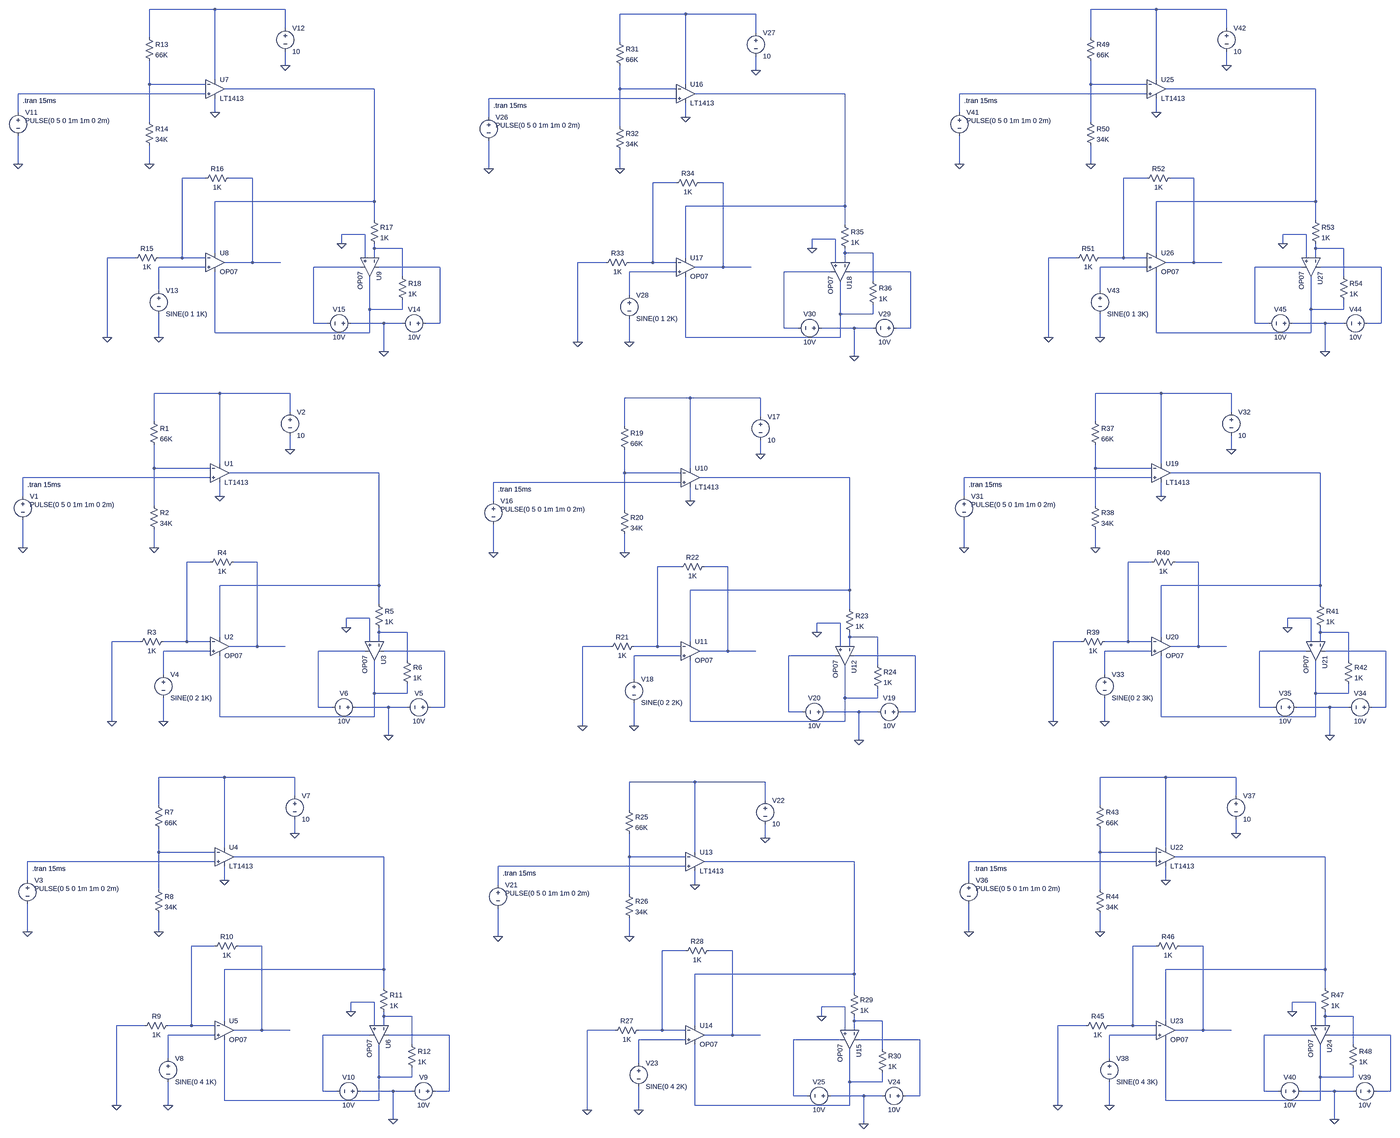
[diagram p0: schematic spice3a.asc, whole sheet]
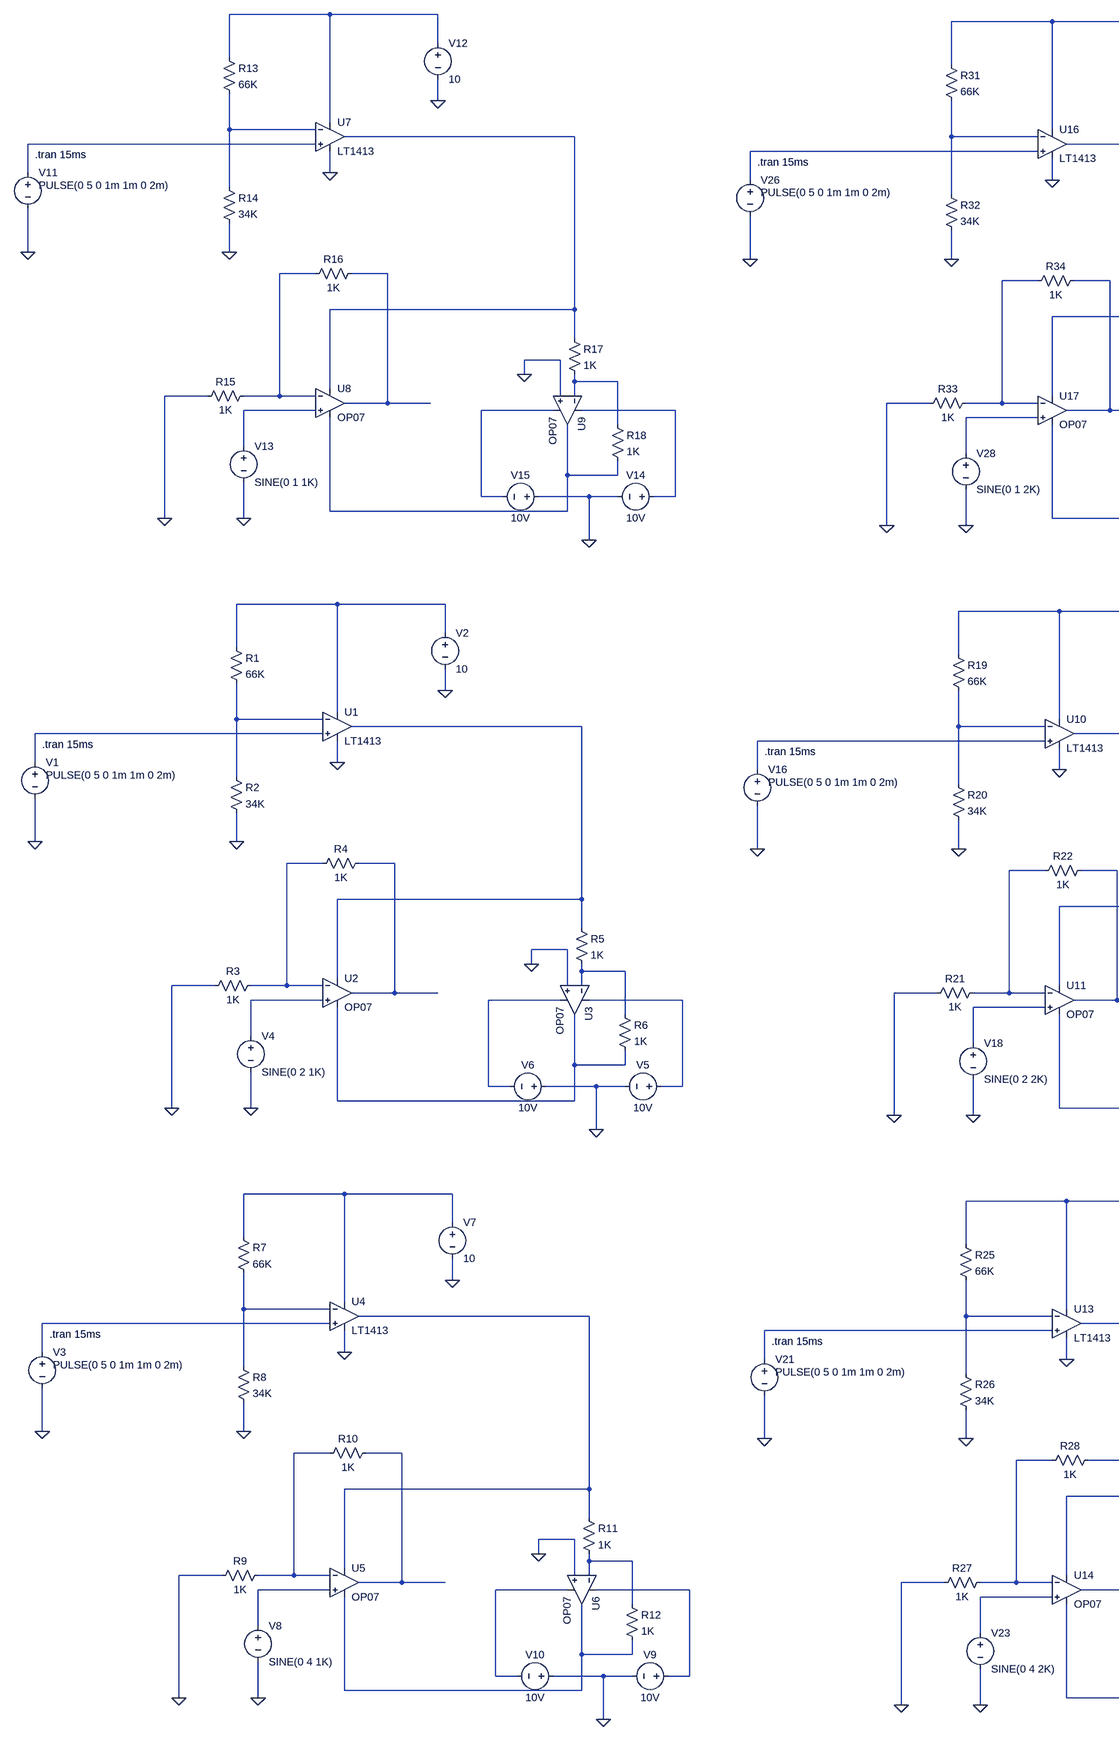
[diagram p1: schematic spice3a.asc, part, row 1 of 1, column 1 of 2]
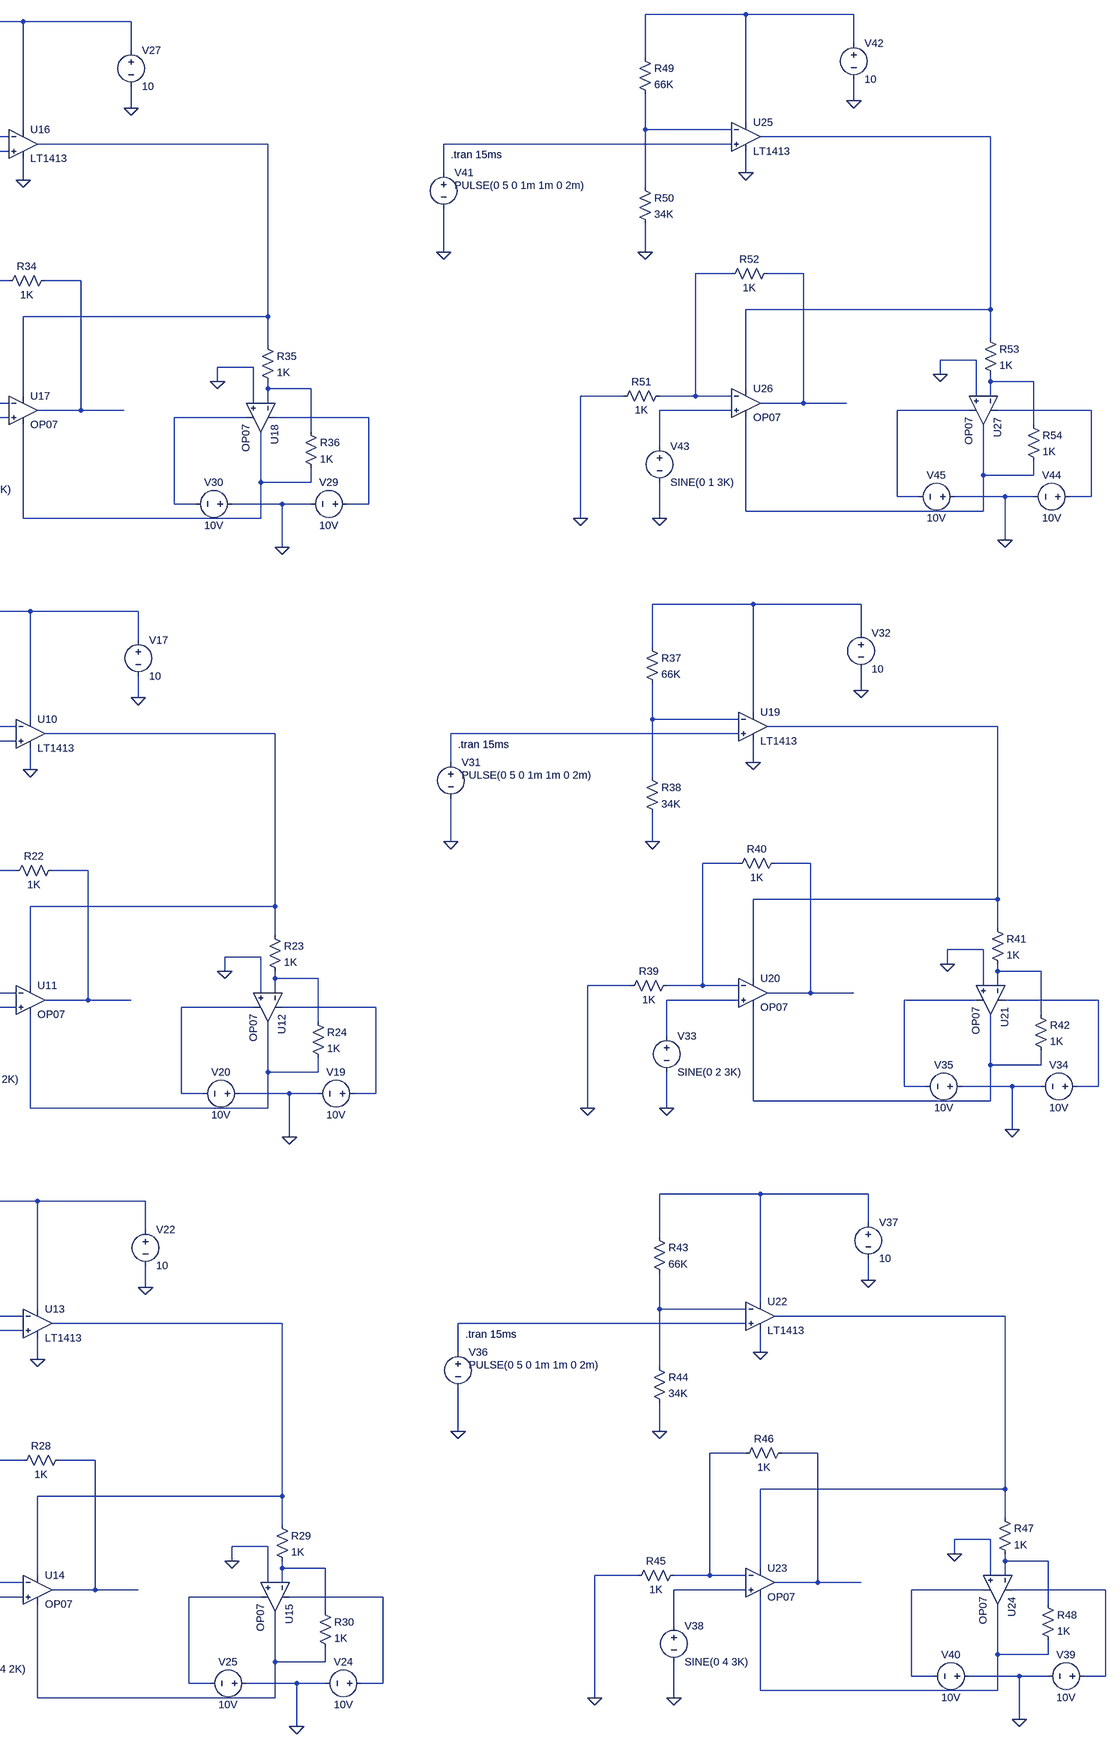
[diagram p2: schematic spice3a.asc, part, row 1 of 1, column 2 of 2]
spice3a.asc, the LTspice schematic file:
Version 4
SHEET 1 5652 2292
WIRE 528 -2000 304 -2000
WIRE 768 -2000 528 -2000
WIRE 4848 -2000 4624 -2000
WIRE 5088 -2000 4848 -2000
WIRE 2656 -1984 2432 -1984
WIRE 2896 -1984 2656 -1984
WIRE 768 -1936 768 -2000
WIRE 5088 -1936 5088 -2000
WIRE 2896 -1920 2896 -1984
WIRE 304 -1904 304 -2000
WIRE 4624 -1904 4624 -2000
WIRE 2432 -1888 2432 -1984
WIRE 768 -1808 768 -1856
WIRE 5088 -1808 5088 -1856
WIRE 2896 -1792 2896 -1840
WIRE 528 -1760 528 -2000
WIRE 4848 -1760 4848 -2000
WIRE 304 -1744 304 -1824
WIRE 496 -1744 304 -1744
WIRE 2656 -1744 2656 -1984
WIRE 4624 -1744 4624 -1824
WIRE 4816 -1744 4624 -1744
WIRE 1072 -1728 560 -1728
WIRE 2432 -1728 2432 -1808
WIRE 2624 -1728 2432 -1728
WIRE 5392 -1728 4880 -1728
WIRE 496 -1712 -144 -1712
WIRE 3200 -1712 2688 -1712
WIRE 4816 -1712 4176 -1712
WIRE 2624 -1696 1984 -1696
WIRE -144 -1648 -144 -1712
WIRE 528 -1648 528 -1696
WIRE 4176 -1648 4176 -1712
WIRE 4848 -1648 4848 -1696
WIRE 1984 -1632 1984 -1696
WIRE 2656 -1632 2656 -1680
WIRE 304 -1616 304 -1744
WIRE 4624 -1616 4624 -1744
WIRE 2432 -1600 2432 -1728
WIRE -144 -1472 -144 -1568
WIRE 304 -1472 304 -1536
WIRE 4176 -1472 4176 -1568
WIRE 4624 -1472 4624 -1536
WIRE 1984 -1456 1984 -1552
WIRE 2432 -1456 2432 -1520
WIRE 496 -1424 416 -1424
WIRE 656 -1424 576 -1424
WIRE 4816 -1424 4736 -1424
WIRE 4976 -1424 4896 -1424
WIRE 2624 -1408 2544 -1408
WIRE 2784 -1408 2704 -1408
WIRE 1072 -1344 1072 -1728
WIRE 1072 -1344 528 -1344
WIRE 5392 -1344 5392 -1728
WIRE 5392 -1344 4848 -1344
WIRE 3200 -1328 3200 -1712
WIRE 3200 -1328 2656 -1328
WIRE 1072 -1280 1072 -1344
WIRE 5392 -1280 5392 -1344
WIRE 3200 -1264 3200 -1328
WIRE 1040 -1232 960 -1232
WIRE 5360 -1232 5280 -1232
WIRE 3168 -1216 3088 -1216
WIRE 960 -1200 960 -1232
WIRE 5280 -1200 5280 -1232
WIRE 1072 -1184 1072 -1200
WIRE 1168 -1184 1072 -1184
WIRE 3088 -1184 3088 -1216
WIRE 5392 -1184 5392 -1200
WIRE 5488 -1184 5392 -1184
WIRE 528 -1168 528 -1344
WIRE 3200 -1168 3200 -1184
WIRE 3296 -1168 3200 -1168
WIRE 4848 -1168 4848 -1344
WIRE 256 -1152 160 -1152
WIRE 416 -1152 416 -1424
WIRE 416 -1152 336 -1152
WIRE 496 -1152 416 -1152
WIRE 1040 -1152 1040 -1232
WIRE 1072 -1152 1072 -1184
WIRE 2656 -1152 2656 -1328
WIRE 4576 -1152 4480 -1152
WIRE 4736 -1152 4736 -1424
WIRE 4736 -1152 4656 -1152
WIRE 4816 -1152 4736 -1152
WIRE 5360 -1152 5360 -1232
WIRE 5392 -1152 5392 -1184
WIRE 656 -1136 656 -1424
WIRE 656 -1136 560 -1136
WIRE 752 -1136 656 -1136
WIRE 2384 -1136 2288 -1136
WIRE 2544 -1136 2544 -1408
WIRE 2544 -1136 2464 -1136
WIRE 2624 -1136 2544 -1136
WIRE 3168 -1136 3168 -1216
WIRE 3200 -1136 3200 -1168
WIRE 4976 -1136 4976 -1424
WIRE 4976 -1136 4880 -1136
WIRE 5072 -1136 4976 -1136
WIRE 496 -1120 336 -1120
WIRE 1024 -1120 864 -1120
WIRE 1296 -1120 1088 -1120
WIRE 2784 -1120 2784 -1408
WIRE 2784 -1120 2688 -1120
WIRE 2880 -1120 2784 -1120
WIRE 4816 -1120 4656 -1120
WIRE 5344 -1120 5184 -1120
WIRE 5616 -1120 5408 -1120
WIRE 2624 -1104 2464 -1104
WIRE 3152 -1104 2992 -1104
WIRE 3424 -1104 3216 -1104
WIRE 1168 -1088 1168 -1184
WIRE 5488 -1088 5488 -1184
WIRE 3296 -1072 3296 -1168
WIRE 336 -1040 336 -1120
WIRE 4656 -1040 4656 -1120
WIRE 2464 -1024 2464 -1104
WIRE 1056 -976 1056 -1088
WIRE 1168 -976 1168 -1008
WIRE 1168 -976 1056 -976
WIRE 5376 -976 5376 -1088
WIRE 5488 -976 5488 -1008
WIRE 5488 -976 5376 -976
WIRE 3184 -960 3184 -1072
WIRE 3296 -960 3296 -992
WIRE 3296 -960 3184 -960
WIRE 864 -928 864 -1120
WIRE 912 -928 864 -928
WIRE 1104 -928 992 -928
WIRE 1168 -928 1104 -928
WIRE 1296 -928 1296 -1120
WIRE 1296 -928 1248 -928
WIRE 5184 -928 5184 -1120
WIRE 5232 -928 5184 -928
WIRE 5424 -928 5312 -928
WIRE 5488 -928 5424 -928
WIRE 5616 -928 5616 -1120
WIRE 5616 -928 5568 -928
WIRE 2992 -912 2992 -1104
WIRE 3040 -912 2992 -912
WIRE 3232 -912 3120 -912
WIRE 3296 -912 3232 -912
WIRE 3424 -912 3424 -1104
WIRE 3424 -912 3376 -912
WIRE 528 -896 528 -1104
WIRE 1056 -896 1056 -976
WIRE 1056 -896 528 -896
WIRE 4848 -896 4848 -1104
WIRE 5376 -896 5376 -976
WIRE 5376 -896 4848 -896
WIRE 160 -880 160 -1152
WIRE 336 -880 336 -960
WIRE 2656 -880 2656 -1088
WIRE 3184 -880 3184 -960
WIRE 3184 -880 2656 -880
WIRE 4480 -880 4480 -1152
WIRE 4656 -880 4656 -960
WIRE 2288 -864 2288 -1136
WIRE 2464 -864 2464 -944
WIRE 1104 -832 1104 -928
WIRE 5424 -832 5424 -928
WIRE 3232 -816 3232 -912
WIRE 544 -416 320 -416
WIRE 784 -416 544 -416
WIRE 4864 -416 4640 -416
WIRE 5104 -416 4864 -416
WIRE 2672 -400 2448 -400
WIRE 2912 -400 2672 -400
WIRE 784 -352 784 -416
WIRE 5104 -352 5104 -416
WIRE 2912 -336 2912 -400
WIRE 320 -320 320 -416
WIRE 4640 -320 4640 -416
WIRE 2448 -304 2448 -400
WIRE 784 -224 784 -272
WIRE 5104 -224 5104 -272
WIRE 2912 -208 2912 -256
WIRE 544 -176 544 -416
WIRE 4864 -176 4864 -416
WIRE 320 -160 320 -240
WIRE 512 -160 320 -160
WIRE 2672 -160 2672 -400
WIRE 4640 -160 4640 -240
WIRE 4832 -160 4640 -160
WIRE 1088 -144 576 -144
WIRE 2448 -144 2448 -224
WIRE 2640 -144 2448 -144
WIRE 5408 -144 4896 -144
WIRE 512 -128 -128 -128
WIRE 3216 -128 2704 -128
WIRE 4832 -128 4192 -128
WIRE 2640 -112 2000 -112
WIRE -128 -64 -128 -128
WIRE 544 -64 544 -112
WIRE 4192 -64 4192 -128
WIRE 4864 -64 4864 -112
WIRE 2000 -48 2000 -112
WIRE 2672 -48 2672 -96
WIRE 320 -32 320 -160
WIRE 4640 -32 4640 -160
WIRE 2448 -16 2448 -144
WIRE -128 112 -128 16
WIRE 320 112 320 48
WIRE 4192 112 4192 16
WIRE 4640 112 4640 48
WIRE 2000 128 2000 32
WIRE 2448 128 2448 64
WIRE 512 160 432 160
WIRE 672 160 592 160
WIRE 4832 160 4752 160
WIRE 4992 160 4912 160
WIRE 2640 176 2560 176
WIRE 2800 176 2720 176
WIRE 1088 240 1088 -144
WIRE 1088 240 544 240
WIRE 5408 240 5408 -144
WIRE 5408 240 4864 240
WIRE 3216 256 3216 -128
WIRE 3216 256 2672 256
WIRE 1088 304 1088 240
WIRE 5408 304 5408 240
WIRE 3216 320 3216 256
WIRE 1056 352 976 352
WIRE 5376 352 5296 352
WIRE 3184 368 3104 368
WIRE 976 384 976 352
WIRE 5296 384 5296 352
WIRE 1088 400 1088 384
WIRE 1184 400 1088 400
WIRE 3104 400 3104 368
WIRE 5408 400 5408 384
WIRE 5504 400 5408 400
WIRE 544 416 544 240
WIRE 3216 416 3216 400
WIRE 3312 416 3216 416
WIRE 4864 416 4864 240
WIRE 272 432 176 432
WIRE 432 432 432 160
WIRE 432 432 352 432
WIRE 512 432 432 432
WIRE 1056 432 1056 352
WIRE 1088 432 1088 400
WIRE 2672 432 2672 256
WIRE 4592 432 4496 432
WIRE 4752 432 4752 160
WIRE 4752 432 4672 432
WIRE 4832 432 4752 432
WIRE 5376 432 5376 352
WIRE 5408 432 5408 400
WIRE 672 448 672 160
WIRE 672 448 576 448
WIRE 768 448 672 448
WIRE 2400 448 2304 448
WIRE 2560 448 2560 176
WIRE 2560 448 2480 448
WIRE 2640 448 2560 448
WIRE 3184 448 3184 368
WIRE 3216 448 3216 416
WIRE 4992 448 4992 160
WIRE 4992 448 4896 448
WIRE 5088 448 4992 448
WIRE 512 464 352 464
WIRE 1040 464 880 464
WIRE 1312 464 1104 464
WIRE 2800 464 2800 176
WIRE 2800 464 2704 464
WIRE 2896 464 2800 464
WIRE 4832 464 4672 464
WIRE 5360 464 5200 464
WIRE 5632 464 5424 464
WIRE 2640 480 2480 480
WIRE 3168 480 3008 480
WIRE 3440 480 3232 480
WIRE 1184 496 1184 400
WIRE 5504 496 5504 400
WIRE 3312 512 3312 416
WIRE 352 544 352 464
WIRE 4672 544 4672 464
WIRE 2480 560 2480 480
WIRE 1072 608 1072 496
WIRE 1184 608 1184 576
WIRE 1184 608 1072 608
WIRE 5392 608 5392 496
WIRE 5504 608 5504 576
WIRE 5504 608 5392 608
WIRE 3200 624 3200 512
WIRE 3312 624 3312 592
WIRE 3312 624 3200 624
WIRE 880 656 880 464
WIRE 928 656 880 656
WIRE 1120 656 1008 656
WIRE 1184 656 1120 656
WIRE 1312 656 1312 464
WIRE 1312 656 1264 656
WIRE 5200 656 5200 464
WIRE 5248 656 5200 656
WIRE 5440 656 5328 656
WIRE 5504 656 5440 656
WIRE 5632 656 5632 464
WIRE 5632 656 5584 656
WIRE 3008 672 3008 480
WIRE 3056 672 3008 672
WIRE 3248 672 3136 672
WIRE 3312 672 3248 672
WIRE 3440 672 3440 480
WIRE 3440 672 3392 672
WIRE 544 688 544 480
WIRE 1072 688 1072 608
WIRE 1072 688 544 688
WIRE 4864 688 4864 480
WIRE 5392 688 5392 608
WIRE 5392 688 4864 688
WIRE 176 704 176 432
WIRE 352 704 352 624
WIRE 2672 704 2672 496
WIRE 3200 704 3200 624
WIRE 3200 704 2672 704
WIRE 4496 704 4496 432
WIRE 4672 704 4672 624
WIRE 2304 720 2304 448
WIRE 2480 720 2480 640
WIRE 1120 752 1120 656
WIRE 5440 752 5440 656
WIRE 3248 768 3248 672
WIRE 560 1088 336 1088
WIRE 800 1088 560 1088
WIRE 4880 1088 4656 1088
WIRE 5120 1088 4880 1088
WIRE 2688 1104 2464 1104
WIRE 2928 1104 2688 1104
WIRE 800 1152 800 1088
WIRE 5120 1152 5120 1088
WIRE 2928 1168 2928 1104
WIRE 336 1184 336 1088
WIRE 4656 1184 4656 1088
WIRE 2464 1200 2464 1104
WIRE 800 1280 800 1232
WIRE 5120 1280 5120 1232
WIRE 2928 1296 2928 1248
WIRE 560 1328 560 1088
WIRE 4880 1328 4880 1088
WIRE 336 1344 336 1264
WIRE 528 1344 336 1344
WIRE 2688 1344 2688 1104
WIRE 4656 1344 4656 1264
WIRE 4848 1344 4656 1344
WIRE 1104 1360 592 1360
WIRE 2464 1360 2464 1280
WIRE 2656 1360 2464 1360
WIRE 5424 1360 4912 1360
WIRE 528 1376 -112 1376
WIRE 3232 1376 2720 1376
WIRE 4848 1376 4208 1376
WIRE 2656 1392 2016 1392
WIRE -112 1440 -112 1376
WIRE 560 1440 560 1392
WIRE 4208 1440 4208 1376
WIRE 4880 1440 4880 1392
WIRE 2016 1456 2016 1392
WIRE 2688 1456 2688 1408
WIRE 336 1472 336 1344
WIRE 4656 1472 4656 1344
WIRE 2464 1488 2464 1360
WIRE -112 1616 -112 1520
WIRE 336 1616 336 1552
WIRE 4208 1616 4208 1520
WIRE 4656 1616 4656 1552
WIRE 2016 1632 2016 1536
WIRE 2464 1632 2464 1568
WIRE 528 1664 448 1664
WIRE 688 1664 608 1664
WIRE 4848 1664 4768 1664
WIRE 5008 1664 4928 1664
WIRE 2656 1680 2576 1680
WIRE 2816 1680 2736 1680
WIRE 1104 1744 1104 1360
WIRE 1104 1744 560 1744
WIRE 5424 1744 5424 1360
WIRE 5424 1744 4880 1744
WIRE 3232 1760 3232 1376
WIRE 3232 1760 2688 1760
WIRE 1104 1808 1104 1744
WIRE 5424 1808 5424 1744
WIRE 3232 1824 3232 1760
WIRE 1072 1856 992 1856
WIRE 5392 1856 5312 1856
WIRE 3200 1872 3120 1872
WIRE 992 1888 992 1856
WIRE 5312 1888 5312 1856
WIRE 1104 1904 1104 1888
WIRE 1200 1904 1104 1904
WIRE 3120 1904 3120 1872
WIRE 5424 1904 5424 1888
WIRE 5520 1904 5424 1904
WIRE 560 1920 560 1744
WIRE 3232 1920 3232 1904
WIRE 3328 1920 3232 1920
WIRE 4880 1920 4880 1744
WIRE 288 1936 192 1936
WIRE 448 1936 448 1664
WIRE 448 1936 368 1936
WIRE 528 1936 448 1936
WIRE 1072 1936 1072 1856
WIRE 1104 1936 1104 1904
WIRE 2688 1936 2688 1760
WIRE 4608 1936 4512 1936
WIRE 4768 1936 4768 1664
WIRE 4768 1936 4688 1936
WIRE 4848 1936 4768 1936
WIRE 5392 1936 5392 1856
WIRE 5424 1936 5424 1904
WIRE 688 1952 688 1664
WIRE 688 1952 592 1952
WIRE 784 1952 688 1952
WIRE 2416 1952 2320 1952
WIRE 2576 1952 2576 1680
WIRE 2576 1952 2496 1952
WIRE 2656 1952 2576 1952
WIRE 3200 1952 3200 1872
WIRE 3232 1952 3232 1920
WIRE 5008 1952 5008 1664
WIRE 5008 1952 4912 1952
WIRE 5104 1952 5008 1952
WIRE 528 1968 368 1968
WIRE 1056 1968 896 1968
WIRE 1328 1968 1120 1968
WIRE 2816 1968 2816 1680
WIRE 2816 1968 2720 1968
WIRE 2912 1968 2816 1968
WIRE 4848 1968 4688 1968
WIRE 5376 1968 5216 1968
WIRE 5648 1968 5440 1968
WIRE 2656 1984 2496 1984
WIRE 3184 1984 3024 1984
WIRE 3456 1984 3248 1984
WIRE 1200 2000 1200 1904
WIRE 5520 2000 5520 1904
WIRE 3328 2016 3328 1920
WIRE 368 2048 368 1968
WIRE 4688 2048 4688 1968
WIRE 2496 2064 2496 1984
WIRE 1088 2112 1088 2000
WIRE 1200 2112 1200 2080
WIRE 1200 2112 1088 2112
WIRE 5408 2112 5408 2000
WIRE 5520 2112 5520 2080
WIRE 5520 2112 5408 2112
WIRE 3216 2128 3216 2016
WIRE 3328 2128 3328 2096
WIRE 3328 2128 3216 2128
WIRE 896 2160 896 1968
WIRE 944 2160 896 2160
WIRE 1136 2160 1024 2160
WIRE 1200 2160 1136 2160
WIRE 1328 2160 1328 1968
WIRE 1328 2160 1280 2160
WIRE 5216 2160 5216 1968
WIRE 5264 2160 5216 2160
WIRE 5456 2160 5344 2160
WIRE 5520 2160 5456 2160
WIRE 5648 2160 5648 1968
WIRE 5648 2160 5600 2160
WIRE 3024 2176 3024 1984
WIRE 3072 2176 3024 2176
WIRE 3264 2176 3152 2176
WIRE 3328 2176 3264 2176
WIRE 3456 2176 3456 1984
WIRE 3456 2176 3408 2176
WIRE 560 2192 560 1984
WIRE 1088 2192 1088 2112
WIRE 1088 2192 560 2192
WIRE 4880 2192 4880 1984
WIRE 5408 2192 5408 2112
WIRE 5408 2192 4880 2192
WIRE 192 2208 192 1936
WIRE 368 2208 368 2128
WIRE 2688 2208 2688 2000
WIRE 3216 2208 3216 2128
WIRE 3216 2208 2688 2208
WIRE 4512 2208 4512 1936
WIRE 4688 2208 4688 2128
WIRE 2320 2224 2320 1952
WIRE 2496 2224 2496 2144
WIRE 1136 2256 1136 2160
WIRE 5456 2256 5456 2160
WIRE 3264 2272 3264 2176
FLAG -128 112 0
FLAG 784 -224 0
FLAG 320 112 0
FLAG 544 -64 0
FLAG 352 704 0
FLAG 176 704 0
FLAG 976 384 0
FLAG 1120 752 0
FLAG -112 1616 0
FLAG 800 1280 0
FLAG 336 1616 0
FLAG 560 1440 0
FLAG 368 2208 0
FLAG 192 2208 0
FLAG 992 1888 0
FLAG 1136 2256 0
FLAG -144 -1472 0
FLAG 768 -1808 0
FLAG 304 -1472 0
FLAG 528 -1648 0
FLAG 336 -880 0
FLAG 160 -880 0
FLAG 960 -1200 0
FLAG 1104 -832 0
FLAG 2000 128 0
FLAG 2912 -208 0
FLAG 2448 128 0
FLAG 2672 -48 0
FLAG 2480 720 0
FLAG 2304 720 0
FLAG 3104 400 0
FLAG 3248 768 0
FLAG 2016 1632 0
FLAG 2928 1296 0
FLAG 2464 1632 0
FLAG 2688 1456 0
FLAG 2496 2224 0
FLAG 2320 2224 0
FLAG 3120 1904 0
FLAG 3264 2272 0
FLAG 1984 -1456 0
FLAG 2896 -1792 0
FLAG 2432 -1456 0
FLAG 2656 -1632 0
FLAG 2464 -864 0
FLAG 2288 -864 0
FLAG 3088 -1184 0
FLAG 3232 -816 0
FLAG 4192 112 0
FLAG 5104 -224 0
FLAG 4640 112 0
FLAG 4864 -64 0
FLAG 4672 704 0
FLAG 4496 704 0
FLAG 5296 384 0
FLAG 5440 752 0
FLAG 4208 1616 0
FLAG 5120 1280 0
FLAG 4656 1616 0
FLAG 4880 1440 0
FLAG 4688 2208 0
FLAG 4512 2208 0
FLAG 5312 1888 0
FLAG 5456 2256 0
FLAG 4176 -1472 0
FLAG 5088 -1808 0
FLAG 4624 -1472 0
FLAG 4848 -1648 0
FLAG 4656 -880 0
FLAG 4480 -880 0
FLAG 5280 -1200 0
FLAG 5424 -832 0
SYMBOL voltage -128 -80 R0
WINDOW 3 24 44 Left 2
WINDOW 123 0 0 Left 0
WINDOW 39 0 0 Left 0
SYMATTR Value PULSE(0 5 0 1m 1m 0 2m)
SYMATTR InstName V1
SYMBOL OpAmps\\LT1413 544 -208 R0
SYMATTR InstName U1
SYMBOL res 304 -336 R0
SYMATTR InstName R1
SYMATTR Value 66K
SYMBOL res 304 -48 R0
SYMATTR InstName R2
SYMATTR Value 34K
SYMBOL voltage 784 -368 R0
WINDOW 123 0 0 Left 0
WINDOW 39 0 0 Left 0
SYMATTR InstName V2
SYMATTR Value 10
SYMBOL OpAmps\\OP07 544 384 R0
SYMATTR InstName U2
SYMBOL voltage 352 528 R0
WINDOW 123 0 0 Left 0
WINDOW 39 0 0 Left 0
SYMATTR InstName V4
SYMATTR Value SINE(0 2 1K)
SYMBOL res 368 416 R90
WINDOW 0 0 56 VBottom 2
WINDOW 3 32 56 VTop 2
SYMATTR InstName R3
SYMATTR Value 1K
SYMBOL res 608 144 R90
WINDOW 0 0 56 VBottom 2
WINDOW 3 32 56 VTop 2
SYMATTR InstName R4
SYMATTR Value 1K
SYMBOL OpAmps\\OP07 1136 464 R90
SYMATTR InstName U3
SYMBOL res 1072 288 R0
SYMATTR InstName R5
SYMATTR Value 1K
SYMBOL voltage 1280 656 R90
WINDOW 0 -32 56 VBottom 2
WINDOW 3 32 56 VTop 2
WINDOW 123 0 0 Left 0
WINDOW 39 0 0 Left 0
SYMATTR InstName V5
SYMATTR Value 10V
SYMBOL voltage 1024 656 R90
WINDOW 0 -32 56 VBottom 2
WINDOW 3 32 56 VTop 2
WINDOW 123 0 0 Left 0
WINDOW 39 0 0 Left 0
SYMATTR InstName V6
SYMATTR Value 10V
SYMBOL res 1168 480 R0
SYMATTR InstName R6
SYMATTR Value 1K
SYMBOL voltage -112 1424 R0
WINDOW 3 24 44 Left 2
WINDOW 123 0 0 Left 0
WINDOW 39 0 0 Left 0
SYMATTR Value PULSE(0 5 0 1m 1m 0 2m)
SYMATTR InstName V3
SYMBOL OpAmps\\LT1413 560 1296 R0
SYMATTR InstName U4
SYMBOL res 320 1168 R0
SYMATTR InstName R7
SYMATTR Value 66K
SYMBOL res 320 1456 R0
SYMATTR InstName R8
SYMATTR Value 34K
SYMBOL voltage 800 1136 R0
WINDOW 123 0 0 Left 0
WINDOW 39 0 0 Left 0
SYMATTR InstName V7
SYMATTR Value 10
SYMBOL OpAmps\\OP07 560 1888 R0
SYMATTR InstName U5
SYMBOL voltage 368 2032 R0
WINDOW 123 0 0 Left 0
WINDOW 39 0 0 Left 0
SYMATTR InstName V8
SYMATTR Value SINE(0 4 1K)
SYMBOL res 384 1920 R90
WINDOW 0 0 56 VBottom 2
WINDOW 3 32 56 VTop 2
SYMATTR InstName R9
SYMATTR Value 1K
SYMBOL res 624 1648 R90
WINDOW 0 0 56 VBottom 2
WINDOW 3 32 56 VTop 2
SYMATTR InstName R10
SYMATTR Value 1K
SYMBOL OpAmps\\OP07 1152 1968 R90
SYMATTR InstName U6
SYMBOL res 1088 1792 R0
SYMATTR InstName R11
SYMATTR Value 1K
SYMBOL voltage 1296 2160 R90
WINDOW 0 -32 56 VBottom 2
WINDOW 3 32 56 VTop 2
WINDOW 123 0 0 Left 0
WINDOW 39 0 0 Left 0
SYMATTR InstName V9
SYMATTR Value 10V
SYMBOL voltage 1040 2160 R90
WINDOW 0 -32 56 VBottom 2
WINDOW 3 32 56 VTop 2
WINDOW 123 0 0 Left 0
WINDOW 39 0 0 Left 0
SYMATTR InstName V10
SYMATTR Value 10V
SYMBOL res 1184 1984 R0
SYMATTR InstName R12
SYMATTR Value 1K
SYMBOL voltage -144 -1664 R0
WINDOW 3 24 44 Left 2
WINDOW 123 0 0 Left 0
WINDOW 39 0 0 Left 0
SYMATTR Value PULSE(0 5 0 1m 1m 0 2m)
SYMATTR InstName V11
SYMBOL OpAmps\\LT1413 528 -1792 R0
SYMATTR InstName U7
SYMBOL res 288 -1920 R0
SYMATTR InstName R13
SYMATTR Value 66K
SYMBOL res 288 -1632 R0
SYMATTR InstName R14
SYMATTR Value 34K
SYMBOL voltage 768 -1952 R0
WINDOW 123 0 0 Left 0
WINDOW 39 0 0 Left 0
SYMATTR InstName V12
SYMATTR Value 10
SYMBOL OpAmps\\OP07 528 -1200 R0
SYMATTR InstName U8
SYMBOL voltage 336 -1056 R0
WINDOW 123 0 0 Left 0
WINDOW 39 0 0 Left 0
SYMATTR InstName V13
SYMATTR Value SINE(0 1 1K)
SYMBOL res 352 -1168 R90
WINDOW 0 0 56 VBottom 2
WINDOW 3 32 56 VTop 2
SYMATTR InstName R15
SYMATTR Value 1K
SYMBOL res 592 -1440 R90
WINDOW 0 0 56 VBottom 2
WINDOW 3 32 56 VTop 2
SYMATTR InstName R16
SYMATTR Value 1K
SYMBOL OpAmps\\OP07 1120 -1120 R90
SYMATTR InstName U9
SYMBOL res 1056 -1296 R0
SYMATTR InstName R17
SYMATTR Value 1K
SYMBOL voltage 1264 -928 R90
WINDOW 0 -32 56 VBottom 2
WINDOW 3 32 56 VTop 2
WINDOW 123 0 0 Left 0
WINDOW 39 0 0 Left 0
SYMATTR InstName V14
SYMATTR Value 10V
SYMBOL voltage 1008 -928 R90
WINDOW 0 -32 56 VBottom 2
WINDOW 3 32 56 VTop 2
WINDOW 123 0 0 Left 0
WINDOW 39 0 0 Left 0
SYMATTR InstName V15
SYMATTR Value 10V
SYMBOL res 1152 -1104 R0
SYMATTR InstName R18
SYMATTR Value 1K
SYMBOL voltage 2000 -64 R0
WINDOW 3 24 44 Left 2
WINDOW 123 0 0 Left 0
WINDOW 39 0 0 Left 0
SYMATTR Value PULSE(0 5 0 1m 1m 0 2m)
SYMATTR InstName V16
SYMBOL OpAmps\\LT1413 2672 -192 R0
SYMATTR InstName U10
SYMBOL res 2432 -320 R0
SYMATTR InstName R19
SYMATTR Value 66K
SYMBOL res 2432 -32 R0
SYMATTR InstName R20
SYMATTR Value 34K
SYMBOL voltage 2912 -352 R0
WINDOW 123 0 0 Left 0
WINDOW 39 0 0 Left 0
SYMATTR InstName V17
SYMATTR Value 10
SYMBOL OpAmps\\OP07 2672 400 R0
SYMATTR InstName U11
SYMBOL voltage 2480 544 R0
WINDOW 123 0 0 Left 0
WINDOW 39 0 0 Left 0
SYMATTR InstName V18
SYMATTR Value SINE(0 2 2K)
SYMBOL res 2496 432 R90
WINDOW 0 0 56 VBottom 2
WINDOW 3 32 56 VTop 2
SYMATTR InstName R21
SYMATTR Value 1K
SYMBOL res 2736 160 R90
WINDOW 0 0 56 VBottom 2
WINDOW 3 32 56 VTop 2
SYMATTR InstName R22
SYMATTR Value 1K
SYMBOL OpAmps\\OP07 3264 480 R90
SYMATTR InstName U12
SYMBOL res 3200 304 R0
SYMATTR InstName R23
SYMATTR Value 1K
SYMBOL voltage 3408 672 R90
WINDOW 0 -32 56 VBottom 2
WINDOW 3 32 56 VTop 2
WINDOW 123 0 0 Left 0
WINDOW 39 0 0 Left 0
SYMATTR InstName V19
SYMATTR Value 10V
SYMBOL voltage 3152 672 R90
WINDOW 0 -32 56 VBottom 2
WINDOW 3 32 56 VTop 2
WINDOW 123 0 0 Left 0
WINDOW 39 0 0 Left 0
SYMATTR InstName V20
SYMATTR Value 10V
SYMBOL res 3296 496 R0
SYMATTR InstName R24
SYMATTR Value 1K
SYMBOL voltage 2016 1440 R0
WINDOW 3 24 44 Left 2
WINDOW 123 0 0 Left 0
WINDOW 39 0 0 Left 0
SYMATTR Value PULSE(0 5 0 1m 1m 0 2m)
SYMATTR InstName V21
SYMBOL OpAmps\\LT1413 2688 1312 R0
SYMATTR InstName U13
SYMBOL res 2448 1184 R0
SYMATTR InstName R25
SYMATTR Value 66K
SYMBOL res 2448 1472 R0
SYMATTR InstName R26
SYMATTR Value 34K
SYMBOL voltage 2928 1152 R0
WINDOW 123 0 0 Left 0
WINDOW 39 0 0 Left 0
SYMATTR InstName V22
SYMATTR Value 10
SYMBOL OpAmps\\OP07 2688 1904 R0
SYMATTR InstName U14
SYMBOL voltage 2496 2048 R0
WINDOW 123 0 0 Left 0
WINDOW 39 0 0 Left 0
SYMATTR InstName V23
SYMATTR Value SINE(0 4 2K)
SYMBOL res 2512 1936 R90
WINDOW 0 0 56 VBottom 2
WINDOW 3 32 56 VTop 2
SYMATTR InstName R27
SYMATTR Value 1K
SYMBOL res 2752 1664 R90
WINDOW 0 0 56 VBottom 2
WINDOW 3 32 56 VTop 2
SYMATTR InstName R28
SYMATTR Value 1K
SYMBOL OpAmps\\OP07 3280 1984 R90
SYMATTR InstName U15
SYMBOL res 3216 1808 R0
SYMATTR InstName R29
SYMATTR Value 1K
SYMBOL voltage 3424 2176 R90
WINDOW 0 -32 56 VBottom 2
WINDOW 3 32 56 VTop 2
WINDOW 123 0 0 Left 0
WINDOW 39 0 0 Left 0
SYMATTR InstName V24
SYMATTR Value 10V
SYMBOL voltage 3168 2176 R90
WINDOW 0 -32 56 VBottom 2
WINDOW 3 32 56 VTop 2
WINDOW 123 0 0 Left 0
WINDOW 39 0 0 Left 0
SYMATTR InstName V25
SYMATTR Value 10V
SYMBOL res 3312 2000 R0
SYMATTR InstName R30
SYMATTR Value 1K
SYMBOL voltage 1984 -1648 R0
WINDOW 3 24 44 Left 2
WINDOW 123 0 0 Left 0
WINDOW 39 0 0 Left 0
SYMATTR Value PULSE(0 5 0 1m 1m 0 2m)
SYMATTR InstName V26
SYMBOL OpAmps\\LT1413 2656 -1776 R0
SYMATTR InstName U16
SYMBOL res 2416 -1904 R0
SYMATTR InstName R31
SYMATTR Value 66K
SYMBOL res 2416 -1616 R0
SYMATTR InstName R32
SYMATTR Value 34K
SYMBOL voltage 2896 -1936 R0
WINDOW 123 0 0 Left 0
WINDOW 39 0 0 Left 0
SYMATTR InstName V27
SYMATTR Value 10
SYMBOL OpAmps\\OP07 2656 -1184 R0
SYMATTR InstName U17
SYMBOL voltage 2464 -1040 R0
WINDOW 123 0 0 Left 0
WINDOW 39 0 0 Left 0
SYMATTR InstName V28
SYMATTR Value SINE(0 1 2K)
SYMBOL res 2480 -1152 R90
WINDOW 0 0 56 VBottom 2
WINDOW 3 32 56 VTop 2
SYMATTR InstName R33
SYMATTR Value 1K
SYMBOL res 2720 -1424 R90
WINDOW 0 0 56 VBottom 2
WINDOW 3 32 56 VTop 2
SYMATTR InstName R34
SYMATTR Value 1K
SYMBOL OpAmps\\OP07 3248 -1104 R90
SYMATTR InstName U18
SYMBOL res 3184 -1280 R0
SYMATTR InstName R35
SYMATTR Value 1K
SYMBOL voltage 3392 -912 R90
WINDOW 0 -32 56 VBottom 2
WINDOW 3 32 56 VTop 2
WINDOW 123 0 0 Left 0
WINDOW 39 0 0 Left 0
SYMATTR InstName V29
SYMATTR Value 10V
SYMBOL voltage 3136 -912 R90
WINDOW 0 -32 56 VBottom 2
WINDOW 3 32 56 VTop 2
WINDOW 123 0 0 Left 0
WINDOW 39 0 0 Left 0
SYMATTR InstName V30
SYMATTR Value 10V
SYMBOL res 3280 -1088 R0
SYMATTR InstName R36
SYMATTR Value 1K
SYMBOL voltage 4192 -80 R0
WINDOW 3 24 44 Left 2
WINDOW 123 0 0 Left 0
WINDOW 39 0 0 Left 0
SYMATTR Value PULSE(0 5 0 1m 1m 0 2m)
SYMATTR InstName V31
SYMBOL OpAmps\\LT1413 4864 -208 R0
SYMATTR InstName U19
SYMBOL res 4624 -336 R0
SYMATTR InstName R37
SYMATTR Value 66K
SYMBOL res 4624 -48 R0
SYMATTR InstName R38
SYMATTR Value 34K
SYMBOL voltage 5104 -368 R0
WINDOW 123 0 0 Left 0
WINDOW 39 0 0 Left 0
SYMATTR InstName V32
SYMATTR Value 10
SYMBOL OpAmps\\OP07 4864 384 R0
SYMATTR InstName U20
SYMBOL voltage 4672 528 R0
WINDOW 123 0 0 Left 0
WINDOW 39 0 0 Left 0
SYMATTR InstName V33
SYMATTR Value SINE(0 2 3K)
SYMBOL res 4688 416 R90
WINDOW 0 0 56 VBottom 2
WINDOW 3 32 56 VTop 2
SYMATTR InstName R39
SYMATTR Value 1K
SYMBOL res 4928 144 R90
WINDOW 0 0 56 VBottom 2
WINDOW 3 32 56 VTop 2
SYMATTR InstName R40
SYMATTR Value 1K
SYMBOL OpAmps\\OP07 5456 464 R90
SYMATTR InstName U21
SYMBOL res 5392 288 R0
SYMATTR InstName R41
SYMATTR Value 1K
SYMBOL voltage 5600 656 R90
WINDOW 0 -32 56 VBottom 2
WINDOW 3 32 56 VTop 2
WINDOW 123 0 0 Left 0
WINDOW 39 0 0 Left 0
SYMATTR InstName V34
SYMATTR Value 10V
SYMBOL voltage 5344 656 R90
WINDOW 0 -32 56 VBottom 2
WINDOW 3 32 56 VTop 2
WINDOW 123 0 0 Left 0
WINDOW 39 0 0 Left 0
SYMATTR InstName V35
SYMATTR Value 10V
SYMBOL res 5488 480 R0
SYMATTR InstName R42
SYMATTR Value 1K
SYMBOL voltage 4208 1424 R0
WINDOW 3 24 44 Left 2
WINDOW 123 0 0 Left 0
WINDOW 39 0 0 Left 0
SYMATTR Value PULSE(0 5 0 1m 1m 0 2m)
SYMATTR InstName V36
SYMBOL OpAmps\\LT1413 4880 1296 R0
SYMATTR InstName U22
SYMBOL res 4640 1168 R0
SYMATTR InstName R43
SYMATTR Value 66K
SYMBOL res 4640 1456 R0
SYMATTR InstName R44
SYMATTR Value 34K
SYMBOL voltage 5120 1136 R0
WINDOW 123 0 0 Left 0
WINDOW 39 0 0 Left 0
SYMATTR InstName V37
SYMATTR Value 10
SYMBOL OpAmps\\OP07 4880 1888 R0
SYMATTR InstName U23
SYMBOL voltage 4688 2032 R0
WINDOW 123 0 0 Left 0
WINDOW 39 0 0 Left 0
SYMATTR InstName V38
SYMATTR Value SINE(0 4 3K)
SYMBOL res 4704 1920 R90
WINDOW 0 0 56 VBottom 2
WINDOW 3 32 56 VTop 2
SYMATTR InstName R45
SYMATTR Value 1K
SYMBOL res 4944 1648 R90
WINDOW 0 0 56 VBottom 2
WINDOW 3 32 56 VTop 2
SYMATTR InstName R46
SYMATTR Value 1K
SYMBOL OpAmps\\OP07 5472 1968 R90
SYMATTR InstName U24
SYMBOL res 5408 1792 R0
SYMATTR InstName R47
SYMATTR Value 1K
SYMBOL voltage 5616 2160 R90
WINDOW 0 -32 56 VBottom 2
WINDOW 3 32 56 VTop 2
WINDOW 123 0 0 Left 0
WINDOW 39 0 0 Left 0
SYMATTR InstName V39
SYMATTR Value 10V
SYMBOL voltage 5360 2160 R90
WINDOW 0 -32 56 VBottom 2
WINDOW 3 32 56 VTop 2
WINDOW 123 0 0 Left 0
WINDOW 39 0 0 Left 0
SYMATTR InstName V40
SYMATTR Value 10V
SYMBOL res 5504 1984 R0
SYMATTR InstName R48
SYMATTR Value 1K
SYMBOL voltage 4176 -1664 R0
WINDOW 3 24 44 Left 2
WINDOW 123 0 0 Left 0
WINDOW 39 0 0 Left 0
SYMATTR Value PULSE(0 5 0 1m 1m 0 2m)
SYMATTR InstName V41
SYMBOL OpAmps\\LT1413 4848 -1792 R0
SYMATTR InstName U25
SYMBOL res 4608 -1920 R0
SYMATTR InstName R49
SYMATTR Value 66K
SYMBOL res 4608 -1632 R0
SYMATTR InstName R50
SYMATTR Value 34K
SYMBOL voltage 5088 -1952 R0
WINDOW 123 0 0 Left 0
WINDOW 39 0 0 Left 0
SYMATTR InstName V42
SYMATTR Value 10
SYMBOL OpAmps\\OP07 4848 -1200 R0
SYMATTR InstName U26
SYMBOL voltage 4656 -1056 R0
WINDOW 123 0 0 Left 0
WINDOW 39 0 0 Left 0
SYMATTR InstName V43
SYMATTR Value SINE(0 1 3K)
SYMBOL res 4672 -1168 R90
WINDOW 0 0 56 VBottom 2
WINDOW 3 32 56 VTop 2
SYMATTR InstName R51
SYMATTR Value 1K
SYMBOL res 4912 -1440 R90
WINDOW 0 0 56 VBottom 2
WINDOW 3 32 56 VTop 2
SYMATTR InstName R52
SYMATTR Value 1K
SYMBOL OpAmps\\OP07 5440 -1120 R90
SYMATTR InstName U27
SYMBOL res 5376 -1296 R0
SYMATTR InstName R53
SYMATTR Value 1K
SYMBOL voltage 5584 -928 R90
WINDOW 0 -32 56 VBottom 2
WINDOW 3 32 56 VTop 2
WINDOW 123 0 0 Left 0
WINDOW 39 0 0 Left 0
SYMATTR InstName V44
SYMATTR Value 10V
SYMBOL voltage 5328 -928 R90
WINDOW 0 -32 56 VBottom 2
WINDOW 3 32 56 VTop 2
WINDOW 123 0 0 Left 0
WINDOW 39 0 0 Left 0
SYMATTR InstName V45
SYMATTR Value 10V
SYMBOL res 5472 -1104 R0
SYMATTR InstName R54
SYMATTR Value 1K
TEXT -112 -104 Left 2 !.tran 15ms
TEXT -96 1400 Left 2 !.tran 15ms
TEXT -128 -1688 Left 2 !.tran 15ms
TEXT 2016 -88 Left 2 !.tran 15ms
TEXT 2032 1416 Left 2 !.tran 15ms
TEXT 2000 -1672 Left 2 !.tran 15ms
TEXT 4208 -104 Left 2 !.tran 15ms
TEXT 4224 1400 Left 2 !.tran 15ms
TEXT 4192 -1688 Left 2 !.tran 15ms

The netlist it stands for:
* spice3a.asc
V1 N042 0 PULSE(0 5 0 1m 1m 0 2m)
XU1 N042 N037 N034 0 N039 LT1413  ; pins In+ In- V+ V- OUT
R1 N034 N037 66K
R2 N037 0 34K
V2 N034 0 10
XU2 N055 N046 N039 N064 N047 LT1001  ; OP07, pins In+ In- V+ V- OUT
V4 N055 0 SINE(0 2 1K)
R3 N046 0 1K
R4 N047 N046 1K
XU3 0 N052 N057 N056 N064 LT1001  ; OP07, pins In+ In- V+ V- OUT
R5 N039 N052 1K
V5 N057 0 10V
V6 0 N056 10V
R6 N052 N064 1K
V3 N075 0 PULSE(0 5 0 1m 1m 0 2m)
XU4 N075 N070 N067 0 N072 LT1413  ; pins In+ In- V+ V- OUT
R7 N067 N070 66K
R8 N070 0 34K
V7 N067 0 10
XU5 N088 N079 N072 N097 N080 LT1001  ; OP07, pins In+ In- V+ V- OUT
V8 N088 0 SINE(0 4 1K)
R9 N079 0 1K
R10 N080 N079 1K
XU6 0 N085 N090 N089 N097 LT1001  ; OP07, pins In+ In- V+ V- OUT
R11 N072 N085 1K
V9 N090 0 10V
V10 0 N089 10V
R12 N085 N097 1K
V11 N009 0 PULSE(0 5 0 1m 1m 0 2m)
XU7 N009 N004 N001 0 N006 LT1413  ; pins In+ In- V+ V- OUT
R13 N001 N004 66K
R14 N004 0 34K
V12 N001 0 10
XU8 N022 N013 N006 N031 N014 LT1001  ; OP07, pins In+ In- V+ V- OUT
V13 N022 0 SINE(0 1 1K)
R15 N013 0 1K
R16 N014 N013 1K
XU9 0 N019 N024 N023 N031 LT1001  ; OP07, pins In+ In- V+ V- OUT
R17 N006 N019 1K
V14 N024 0 10V
V15 0 N023 10V
R18 N019 N031 1K
V16 N045 0 PULSE(0 5 0 1m 1m 0 2m)
XU10 N045 N040 N036 0 N043 LT1413  ; pins In+ In- V+ V- OUT
R19 N036 N040 66K
R20 N040 0 34K
V17 N036 0 10
XU11 N061 N050 N043 N066 N051 LT1001  ; OP07, pins In+ In- V+ V- OUT
V18 N061 0 SINE(0 2 2K)
R21 N050 0 1K
R22 N051 N050 1K
XU12 0 N054 N063 N062 N066 LT1001  ; OP07, pins In+ In- V+ V- OUT
R23 N043 N054 1K
V19 N063 0 10V
V20 0 N062 10V
R24 N054 N066 1K
V21 N078 0 PULSE(0 5 0 1m 1m 0 2m)
XU13 N078 N073 N069 0 N076 LT1413  ; pins In+ In- V+ V- OUT
R25 N069 N073 66K
R26 N073 0 34K
V22 N069 0 10
XU14 N094 N083 N076 N099 N084 LT1001  ; OP07, pins In+ In- V+ V- OUT
V23 N094 0 SINE(0 4 2K)
R27 N083 0 1K
R28 N084 N083 1K
XU15 0 N087 N096 N095 N099 LT1001  ; OP07, pins In+ In- V+ V- OUT
R29 N076 N087 1K
V24 N096 0 10V
V25 0 N095 10V
R30 N087 N099 1K
V26 N012 0 PULSE(0 5 0 1m 1m 0 2m)
XU16 N012 N007 N003 0 N010 LT1413  ; pins In+ In- V+ V- OUT
R31 N003 N007 66K
R32 N007 0 34K
V27 N003 0 10
XU17 N028 N017 N010 N033 N018 LT1001  ; OP07, pins In+ In- V+ V- OUT
V28 N028 0 SINE(0 1 2K)
R33 N017 0 1K
R34 N018 N017 1K
XU18 0 N021 N030 N029 N033 LT1001  ; OP07, pins In+ In- V+ V- OUT
R35 N010 N021 1K
V29 N030 0 10V
V30 0 N029 10V
R36 N021 N033 1K
V31 N044 0 PULSE(0 5 0 1m 1m 0 2m)
XU19 N044 N038 N035 0 N041 LT1413  ; pins In+ In- V+ V- OUT
R37 N035 N038 66K
R38 N038 0 34K
V32 N035 0 10
XU20 N058 N048 N041 N065 N049 LT1001  ; OP07, pins In+ In- V+ V- OUT
V33 N058 0 SINE(0 2 3K)
R39 N048 0 1K
R40 N049 N048 1K
XU21 0 N053 N060 N059 N065 LT1001  ; OP07, pins In+ In- V+ V- OUT
R41 N041 N053 1K
V34 N060 0 10V
V35 0 N059 10V
R42 N053 N065 1K
V36 N077 0 PULSE(0 5 0 1m 1m 0 2m)
XU22 N077 N071 N068 0 N074 LT1413  ; pins In+ In- V+ V- OUT
R43 N068 N071 66K
R44 N071 0 34K
V37 N068 0 10
XU23 N091 N081 N074 N098 N082 LT1001  ; OP07, pins In+ In- V+ V- OUT
V38 N091 0 SINE(0 4 3K)
R45 N081 0 1K
R46 N082 N081 1K
XU24 0 N086 N093 N092 N098 LT1001  ; OP07, pins In+ In- V+ V- OUT
R47 N074 N086 1K
V39 N093 0 10V
V40 0 N092 10V
R48 N086 N098 1K
V41 N011 0 PULSE(0 5 0 1m 1m 0 2m)
XU25 N011 N005 N002 0 N008 LT1413  ; pins In+ In- V+ V- OUT
R49 N002 N005 66K
R50 N005 0 34K
V42 N002 0 10
XU26 N025 N015 N008 N032 N016 LT1001  ; OP07, pins In+ In- V+ V- OUT
V43 N025 0 SINE(0 1 3K)
R51 N015 0 1K
R52 N016 N015 1K
XU27 0 N020 N027 N026 N032 LT1001  ; OP07, pins In+ In- V+ V- OUT
R53 N008 N020 1K
V44 N027 0 10V
V45 0 N026 10V
R54 N020 N032 1K
.tran 15ms
.tran 15ms
.tran 15ms
.tran 15ms
.tran 15ms
.tran 15ms
.tran 15ms
.tran 15ms
.tran 15ms
.lib LTC.lib
.backanno
.end